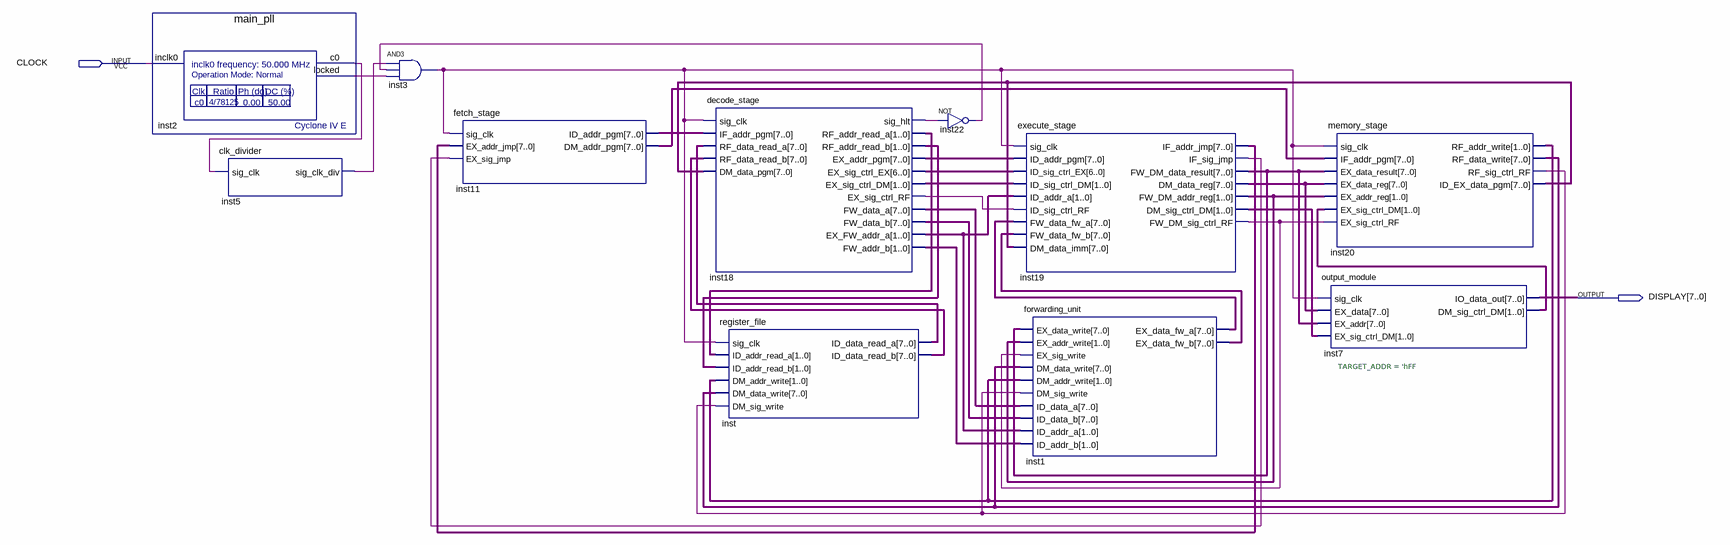
[diagram p0: schematic sheet]
// Quartus schematic smolproc.bdf as structural Verilog: 11 symbols, 2 pins
module smolproc (
  input  CLOCK,
  output [7:0] DISPLAY
);

  wire inst2_c0, inst2_locked, inst3_out, inst5_sig_clk_div, inst18_ex_sig_ctrl_rf, inst18_sig_hlt,
       inst19_fw_dm_sig_ctrl_rf, inst19_if_sig_jmp, inst20_rf_sig_ctrl_rf, inst22_out;
  wire [1:0] inst7_dm_sig_ctrl_dm, inst18_ex_fw_addr_a, inst18_ex_sig_ctrl_dm, inst18_fw_addr_b,
       inst18_rf_addr_read_a, inst18_rf_addr_read_b, inst19_dm_sig_ctrl_dm, inst19_fw_dm_addr_reg,
       inst20_rf_addr_write;
  wire [6:0] inst18_ex_sig_ctrl_ex;
  wire [7:0] inst1_ex_data_fw_a, inst1_ex_data_fw_b, inst11_dm_addr_pgm, inst11_id_addr_pgm,
       inst18_ex_addr_pgm, inst18_fw_data_a, inst18_fw_data_b, inst19_dm_data_reg, inst19_fw_dm_data_result,
       inst19_if_addr_jmp, inst20_id_ex_data_pgm, inst20_rf_data_write, inst_id_data_read_a,
       inst_id_data_read_b;

  main_pll inst2 (.inclk0(CLOCK), .c0(inst2_c0), .locked(inst2_locked));
  clk_divider inst5 (.sig_clk(inst2_c0), .sig_clk_div(inst5_sig_clk_div));
  and inst3 (inst3_out, inst5_sig_clk_div, inst22_out, inst2_locked);
  fetch_stage inst11 (
    .sig_clk(inst3_out), .EX_addr_jmp(inst19_if_addr_jmp), .EX_sig_jmp(inst19_if_sig_jmp),
    .ID_addr_pgm(inst11_id_addr_pgm), .DM_addr_pgm(inst11_dm_addr_pgm));
  decode_stage inst18 (
    .sig_clk(inst3_out), .IF_addr_pgm(inst11_id_addr_pgm), .RF_data_read_a(inst_id_data_read_a),
    .RF_data_read_b(inst_id_data_read_b), .DM_data_pgm(inst20_id_ex_data_pgm), .sig_hlt(inst18_sig_hlt),
    .RF_addr_read_a(inst18_rf_addr_read_a), .RF_addr_read_b(inst18_rf_addr_read_b),
    .EX_addr_pgm(inst18_ex_addr_pgm), .EX_sig_ctrl_EX(inst18_ex_sig_ctrl_ex),
    .EX_sig_ctrl_DM(inst18_ex_sig_ctrl_dm), .EX_sig_ctrl_RF(inst18_ex_sig_ctrl_rf),
    .FW_data_a(inst18_fw_data_a), .FW_data_b(inst18_fw_data_b), .EX_FW_addr_a(inst18_ex_fw_addr_a),
    .FW_addr_b(inst18_fw_addr_b));
  register_file inst (
    .sig_clk(inst3_out), .ID_addr_read_a(inst18_rf_addr_read_a), .ID_addr_read_b(inst18_rf_addr_read_b),
    .DM_addr_write(inst20_rf_addr_write), .DM_data_write(inst20_rf_data_write),
    .DM_sig_write(inst20_rf_sig_ctrl_rf), .ID_data_read_a(inst_id_data_read_a),
    .ID_data_read_b(inst_id_data_read_b));
  not inst22 (inst22_out, inst18_sig_hlt);
  execute_stage inst19 (
    .sig_clk(inst3_out), .ID_addr_pgm(inst18_ex_addr_pgm), .ID_sig_ctrl_EX(inst18_ex_sig_ctrl_ex),
    .ID_sig_ctrl_DM(inst18_ex_sig_ctrl_dm), .ID_addr_a(inst18_ex_fw_addr_a),
    .ID_sig_ctrl_RF(inst18_ex_sig_ctrl_rf), .FW_data_fw_a(inst1_ex_data_fw_a),
    .FW_data_fw_b(inst1_ex_data_fw_b), .DM_data_imm(inst20_id_ex_data_pgm), .IF_addr_jmp(inst19_if_addr_jmp),
    .IF_sig_jmp(inst19_if_sig_jmp), .FW_DM_data_result(inst19_fw_dm_data_result),
    .DM_data_reg(inst19_dm_data_reg), .FW_DM_addr_reg(inst19_fw_dm_addr_reg),
    .DM_sig_ctrl_DM(inst19_dm_sig_ctrl_dm), .FW_DM_sig_ctrl_RF(inst19_fw_dm_sig_ctrl_rf));
  forwarding_unit inst1 (
    .EX_data_write(inst19_fw_dm_data_result), .EX_addr_write(inst19_fw_dm_addr_reg),
    .EX_sig_write(inst19_fw_dm_sig_ctrl_rf), .DM_data_write(inst20_rf_data_write),
    .DM_addr_write(inst20_rf_addr_write), .DM_sig_write(inst20_rf_sig_ctrl_rf), .ID_data_a(inst18_fw_data_a),
    .ID_data_b(inst18_fw_data_b), .ID_addr_a(inst18_ex_fw_addr_a), .ID_addr_b(inst18_fw_addr_b),
    .EX_data_fw_a(inst1_ex_data_fw_a), .EX_data_fw_b(inst1_ex_data_fw_b));
  memory_stage inst20 (
    .sig_clk(inst3_out), .IF_addr_pgm(inst11_dm_addr_pgm), .EX_data_result(inst19_fw_dm_data_result),
    .EX_data_reg(inst19_dm_data_reg), .EX_addr_reg(inst19_fw_dm_addr_reg),
    .EX_sig_ctrl_DM(inst7_dm_sig_ctrl_dm), .EX_sig_ctrl_RF(inst19_fw_dm_sig_ctrl_rf),
    .RF_addr_write(inst20_rf_addr_write), .RF_data_write(inst20_rf_data_write),
    .RF_sig_ctrl_RF(inst20_rf_sig_ctrl_rf), .ID_EX_data_pgm(inst20_id_ex_data_pgm));
  output_module #(.TARGET_ADDR('hFF)) inst7 (
    .sig_clk(inst3_out), .EX_data(inst19_dm_data_reg), .EX_addr(inst19_fw_dm_data_result),
    .EX_sig_ctrl_DM(inst19_dm_sig_ctrl_dm), .IO_data_out(DISPLAY), .DM_sig_ctrl_DM(inst7_dm_sig_ctrl_dm));
endmodule
